# EAGLE design eCog_PWM_Templatesch (EAGLE 6.6.0)
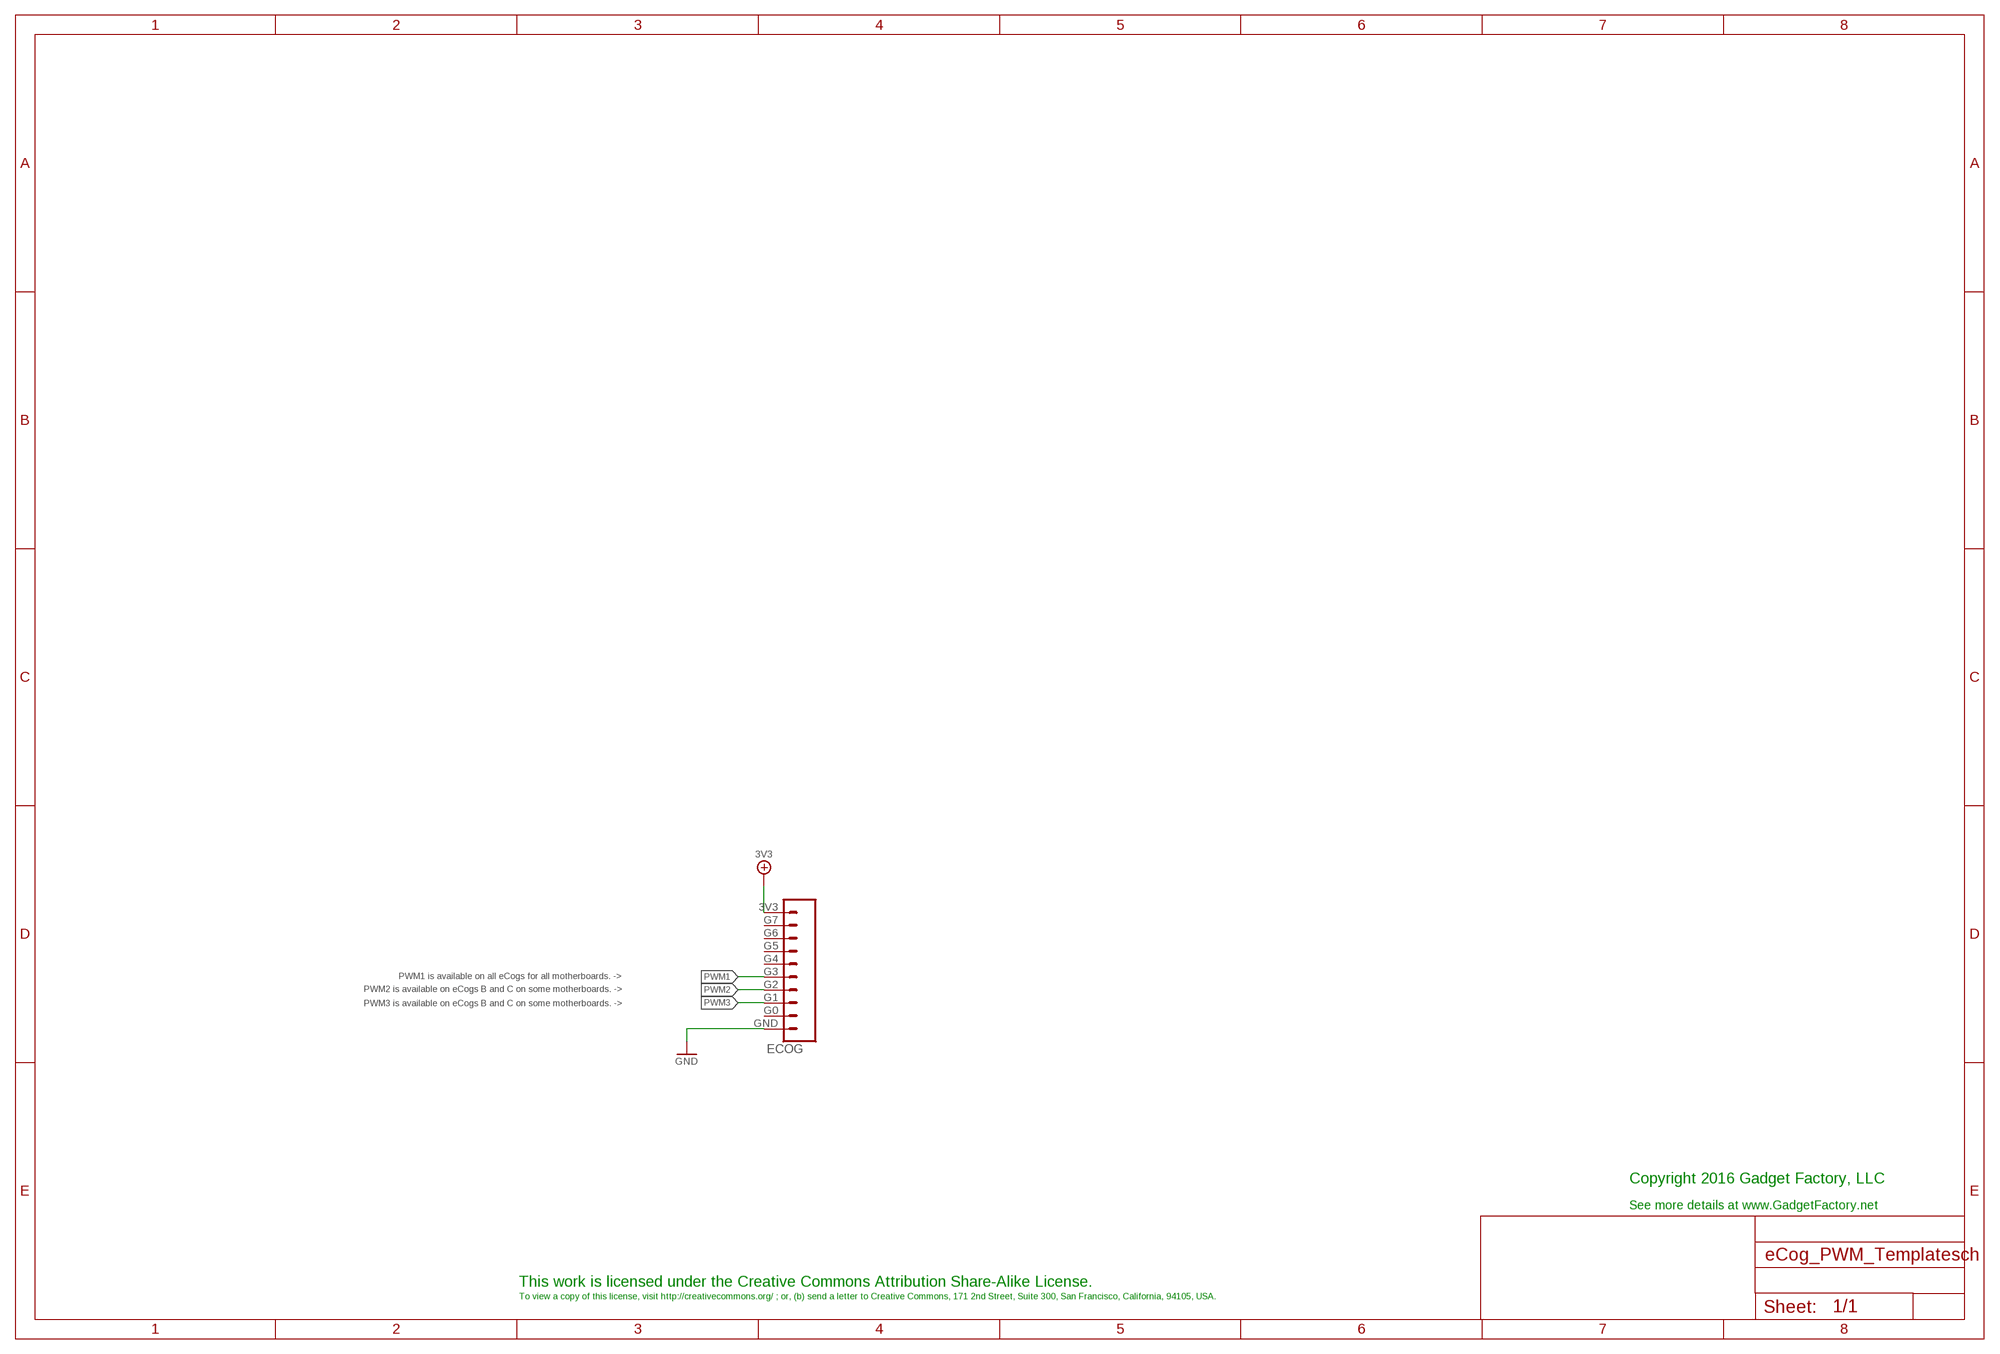
[diagram p0: schematic, sheet 1]

## Parts
ECOG  ECOG_GENERAL_ROWTHROUGHOLE  [ECOG_GENERAL_TH]

## Nets
3V3: ECOG.3V3
GND: ECOG.GND
PWM1: ECOG.G3
PWM2: ECOG.G2
PWM3: ECOG.G1
Unconnected: ECOG.G0 ECOG.G4 ECOG.G5 ECOG.G6 ECOG.G7

## Notes on the sheet
- PWM1 is available on all eCogs for all motherboards. ->
- PWM2 is available on eCogs B and C on some motherboards. ->
- PWM3 is available on eCogs B and C on some motherboards. ->
- Copyright 2016 Gadget Factory, LLC
- See more details at www.GadgetFactory.net
- This work is licensed under the Creative Commons Attribution Share-Alike License.
- To view a copy of this license, visit http://creativecommons.org/ ; or, (b) send a letter to Creative Commons, 171 2nd Street, Suite 300, San Francisco, California, 94105, USA.

## Library data of the parts
ECOG = eCogs:ECOG_GENERAL_ROW

## Board
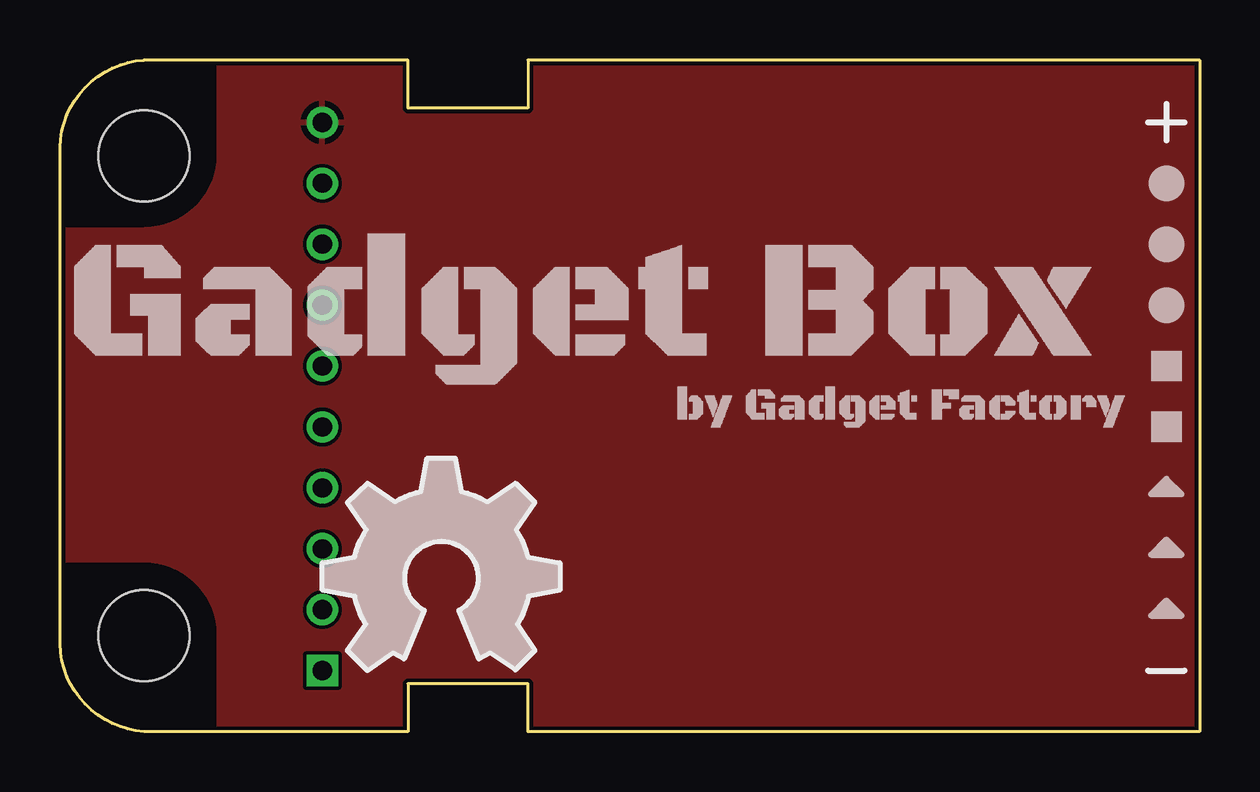
[diagram p1: board, top side]
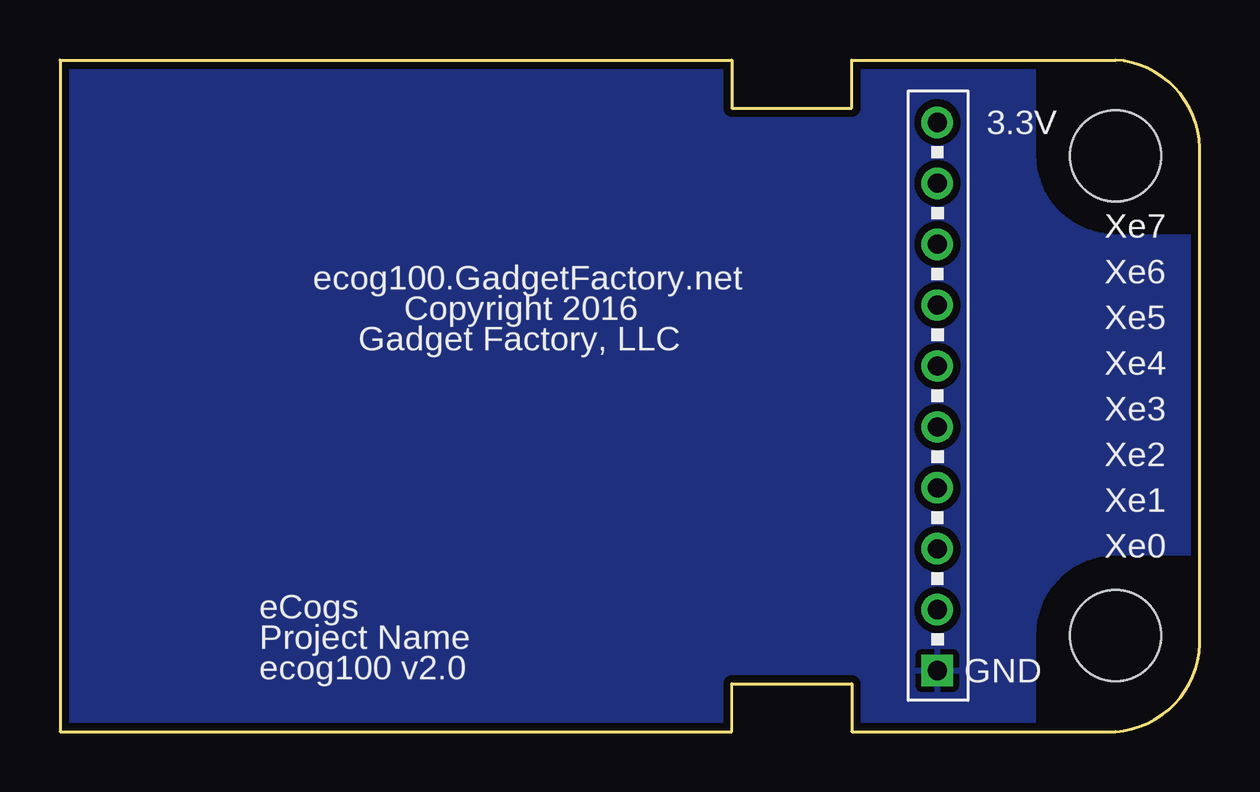
[diagram p2: board, bottom side, seen from below]

Size 47.51 x 28 mm. Coordinates in mm from the lower left corner, seen from the top.
Copper layers (1*16): Top 0.035mm / dielectric 1.5mm / Bottom 0.035mm
Design rules "hackvana *": minimum track width 6mil, minimum drill 0.3mm, track to track 6mil, track to pad 6mil, pad to pad 6mil, via to via 6mil, smd to smd 0mil, copper to edge 6mil, drill to drill 6mil, minimum pad ring 10mil, minimum via ring 6mil, stop-mask expansion 2mil, vias tented up to drill 100mil, thermal gap 10mil

### Footprints (pad centres in the part's own frame; a part is rotated, then mirrored left to right if it is on the bottom)
ECOG_GENERAL_TH = drill 0.8: 3V3 11.43,25.4; G0 11.43,5.08; G1 11.43,7.62; G2 11.43,10.16; G3 11.43,12.7; G4 11.43,15.24; G5 11.43,17.78; G6 11.43,20.32; G7 11.43,22.86 | drill 0.8 square: GND 11.43,2.54 | hole 3.8: 4,24; 4,4

### Placement (x,y rotation side)
ECOG  -0.49,0 0 top
U$1  [GADGETBOX_TEXT]  21.86,17.4 0 top
U$2  [LEGEND_DIO]  46.12,22.86 0 top
U$3  [LEGEND_DIO]  46.12,20.32 0 top
U$4  [LEGEND_DIO]  46.12,17.78 0 top
U$5  [LEGEND_PWM]  46.12,15.24 0 top
U$6  [LEGEND_PWM]  46.12,12.7 0 top
U$7  [LEGEND_ANALOG]  46.12,10.16 0 top
U$8  [LEGEND_ANALOG]  46.12,7.62 0 top
U$9  [LEGEND_ANALOG]  46.12,5.08 0 top
U$10  [OSHW_FILLX350_NOTEXT]  10.94,2.54 0 top

### Tracks (layer width: path | path; a pad name or v marks a point on that pad's centre or on a via)
3V3
  pour Top: -1.49,29 48.51,29 48.51,-1 -1.49,-1
GND
  pour Bottom (isolate 0.305): -2.49,30 49.51,30 49.51,-2 -2.49,-2

### Text on the board
bPlace: 3.3V | Xe7 | Xe6 | Xe5 | ecog100.GadgetFactory.net | Copyright 2016 | Xe4 | Gadget Factory, LLC | Xe3 | Xe2 | Xe1 | Xe0 | eCogs | GND | Project Name | ecog100 v2.0